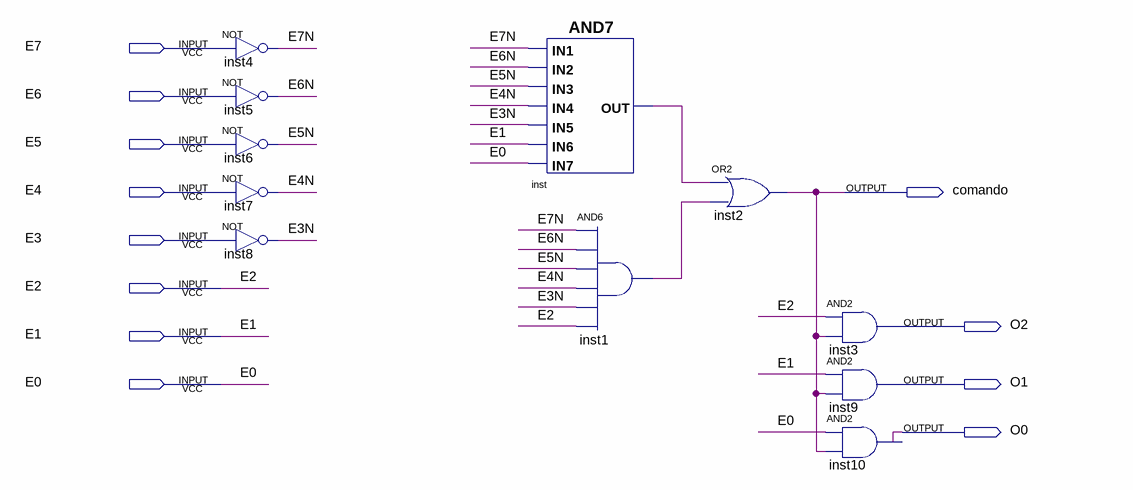
[diagram p0: schematic sheet]
// Quartus schematic verificacao_comando.bdf as structural Verilog: 11 symbols, 12 pins
module verificacao_comando (
  input  E7,
  input  E6,
  input  E5,
  input  E4,
  input  E3,
  input  E2,
  input  E1,
  input  E0,
  output comando,
  output O2,
  output O1,
  output O0
);

  wire E3N, E4N, E5N, E6N, E7N, inst1_out, inst_out;

  not inst4 (E7N, E7);
  not inst5 (E6N, E6);
  not inst6 (E5N, E5);
  not inst7 (E4N, E4);
  not inst8 (E3N, E3);
  and inst (inst_out, E7N, E6N, E5N, E4N, E3N, E1, E0);
  and inst1 (inst1_out, E7N, E6N, E5N, E4N, E3N, E2);
  or inst2 (comando, inst_out, inst1_out);
  and inst3 (O2, E2, comando);
  and inst9 (O1, E1, comando);
  and inst10 (O0, E0, comando);
endmodule
